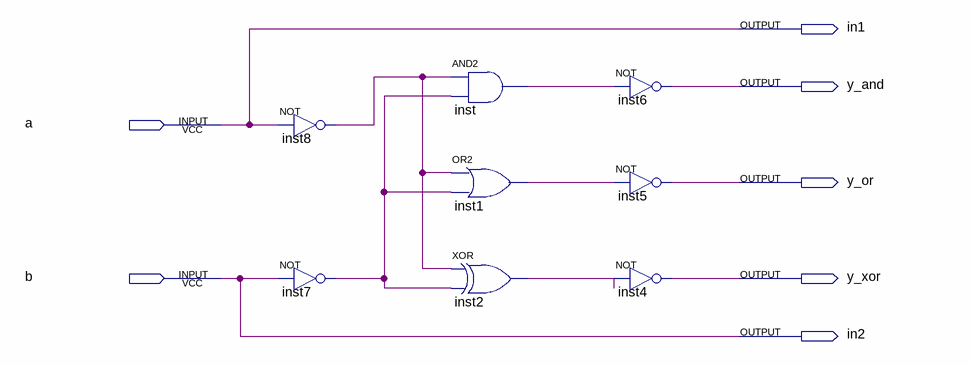
[diagram p0: schematic sheet]
// Quartus schematic Lab5.bdf as structural Verilog: 8 symbols, 7 pins
module Lab5 (
  input  a,
  input  b,
  output in1,
  output y_and,
  output y_or,
  output y_xor,
  output in2
);

  wire inst1_out, inst2_out, inst7_out, inst8_out, inst_out;

  not inst8 (inst8_out, a);
  not inst7 (inst7_out, b);
  and inst (inst_out, inst8_out, inst7_out);
  or inst1 (inst1_out, inst8_out, inst7_out);
  xor inst2 (inst2_out, inst8_out, inst7_out);
  not inst6 (y_and, inst_out);
  not inst5 (y_or, inst1_out);
  not inst4 (y_xor, inst2_out);

  assign in1 = a;
  assign in2 = b;
endmodule
